# EAGLE design Thermocouple-Interface-3V3 (EAGLE 5.11)
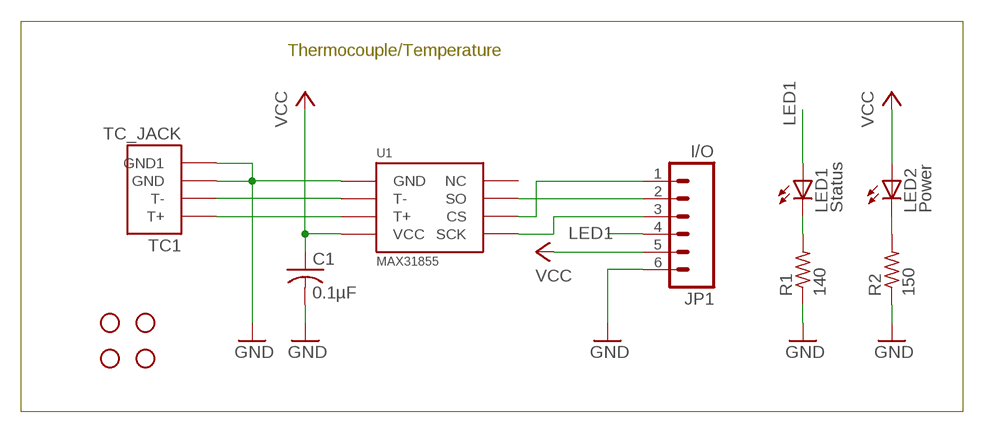
[diagram p0: schematic, sheet 1]

## Parts
C1  0.1µF  C-USC0603  [C0603]
JP1  I/O  M06SIP  [1X06]
LED1  Status  LEDCHIP-LED0805  [CHIP-LED0805]
LED2  Power  LEDCHIP-LED0805  [CHIP-LED0805]
R1  140  R-US_R0603  [R0603]
R2  150  R-US_R0603  [R0603]
TC1  TC_JACK  [TC_JACK]
U1  MAX31855  MAX6675MAX31855  [SOIC-8]
U$1  STAND-OFF  [STAND-OFF]
U$2  STAND-OFF  [STAND-OFF]
U$3  STAND-OFF  [STAND-OFF]
U$4  STAND-OFF  [STAND-OFF]

## Nets
CS: JP1.1 U1.CS
GND: C1.2 JP1.6 R1.1 R2.1 TC1.P$1(GND) TC1.P$2(GND1) U1.GND
LED1: JP1.4 LED1.A
N$1: LED1.C R1.2
N$2: LED2.C R2.2
SCK: JP1.3 U1.SCK
SO: JP1.2 U1.SO
T+: TC1.T+ U1.T+
T-: TC1.T- U1.T-
VCC: C1.1 JP1.5 LED2.A U1.VCC
Unconnected: U1.NC

## Notes on the sheet
- Thermocouple/Temperature

## Library data of the parts
C1 = resistor:C-US: CAPACITOR, American symbol
JP1 = SparkFun:M06: Header 6 Standard 6-pin 0.1" header. Use with straight break away headers (SKU : PRT-00116), right angle break away headers (PRT-00553), swiss pins (PRT-00743), machine pins (PRT-00117), and female headers (PRT-00115). Molex polarized connector foot print use with SKU : PRT-08094 with associated crimp pins and housings. NOTES ON THE VARIANTS LOCK and LOCK_LONGPADS... This footprint was designed to help hold the alignment of a through-hole component (i.e. 6-pin header) while soldering it into place. You may notice that each hole has been shifted either up or down by 0.005 of an inch from it's more standard position (which is a perfectly straight line). This slight alteration caused the pins (the squares in the middle) to touch the edges of the holes. Because they are alternating, it causes a "brace" to hold the component in place. 0.005 has proven to be the perfect amount of "off-center" position when using our standard breakaway headers. Although looks a little odd when you look at the bare footprint, once you have a header in there, the alteration is very hard to notice. Also, if you push a header all the way into place, it is covered up entirely on the bottom side. This idea of altering the position of holes to aid alignment will be further integrated into the Sparkfun Library for other footprints. It can help hold any component with 3 or more connection pins.
LED1 LED2 = led:LED: LED OSRAM: - CHIPLED LG R971, LG N971, LY N971, LG Q971, LY Q971, LO R971, LY R971 LH N974, LH R974 LS Q976, LO Q976, LY Q976 LO Q996 - Hyper CHIPLED LW Q18S LB Q993, LB Q99A, LB R99A - SideLED LS A670, LO A670, LY A670, LG A670, LP A670 LB A673, LV A673, LT A673, LW A673 LH A674 LY A675 LS A676, LA A676, LO A676, LY A676, LW A676 LS A679, LY A679, LG A679 - Hyper Micro SIDELED® LS Y876, LA Y876, LO Y876, LY Y876 LT Y87S - SmartLED LW L88C, LW L88S LB L89C, LB L89S, LG L890 LS L89K, LO L89K, LY L89K LS L896, LA L896, LO L896, LY L896 - TOPLED LS T670, LO T670, LY T670, LG T670, LP T670 LSG T670, LSP T670, LSY T670, LOP T670, LYG T670 LG T671, LOG T671, LSG T671 LB T673, LV T673, LT T673, LW T673 LH T674 LS T676, LA T676, LO T676, LY T676, LB T676, LH T676, LSB T676, LW T676 LB T67C, LV T67C, LT T67C, LS T67K, LO T67K, LY T67K, LW E67C LS E67B, LA E67B, LO E67B, LY E67B, LB E67C, LV E67C, LT E67C LW T67C LS T679, LY T679, LG T679 LS T770, LO T770, LY T770, LG T770, LP T770 LB T773, LV T773, LT T773, LW T773 LH T774 LS E675, LA E675, LY E675, LS T675 LS T776, LA T776, LO T776, LY T776, LB T776 LHGB T686 LT T68C, LB T68C - Hyper Mini TOPLED® LB M676 - Mini TOPLED Santana® LG M470 LS M47K, LO M47K, LY M47K Source: http://www.osram.convergy.de LUXEON: - LUMILED® LXK2-PW12-R00, LXK2-PW12-S00, LXK2-PW14-U00, LXK2-PW14-V00 LXK2-PM12-R00, LXK2-PM12-S00, LXK2-PM14-U00 LXK2-PE12-Q00, LXK2-PE12-R00, LXK2-PE12-S00, LXK2-PE14-T00, LXK2-PE14-U00 LXK2-PB12-K00, LXK2-PB12-L00, LXK2-PB12-M00, LXK2-PB14-N00, LXK2-PB14-P00, LXK2-PB14-Q00 LXK2-PR12-L00, LXK2-PR12-M00, LXK2-PR14-Q00, LXK2-PR14-R00 LXK2-PD12-Q00, LXK2-PD12-R00, LXK2-PD12-S00 LXK2-PH12-R00, LXK2-PH12-S00 LXK2-PL12-P00, LXK2-PL12-Q00, LXK2-PL12-R00 Source: www.luxeon.com KINGBRIGHT: KA-3528ASYC Source: www.kingbright.com
R1 R2 = resistor:R-US_: RESISTOR, American symbol
TC1 = McLaughlinEng:TC_JACK
U1 = McLEng:MAX6675
U$1-U$4 = SparkFun:STAND-OFF: Stand Off This is the mechanical footprint for a #4 phillips button head screw. Use the keepout ring to avoid running the screw head into surrounding components. SKU : PRT-00447

## Board
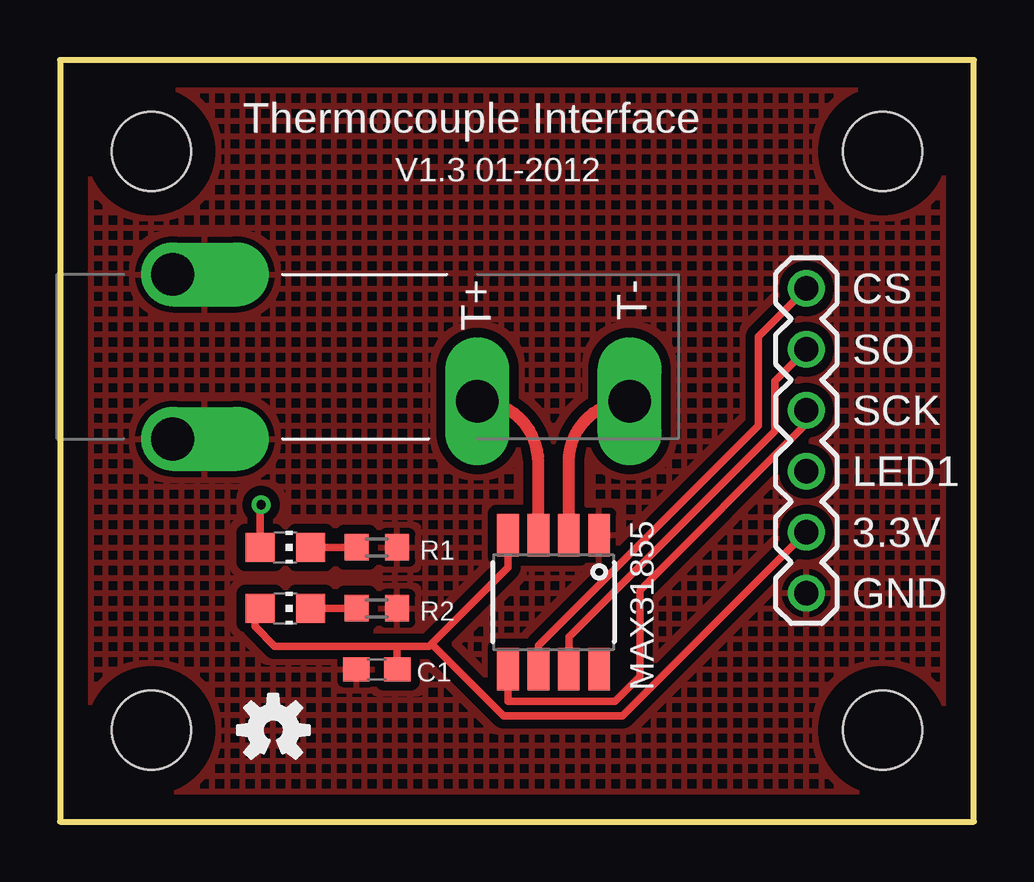
[diagram p1: board, top side]
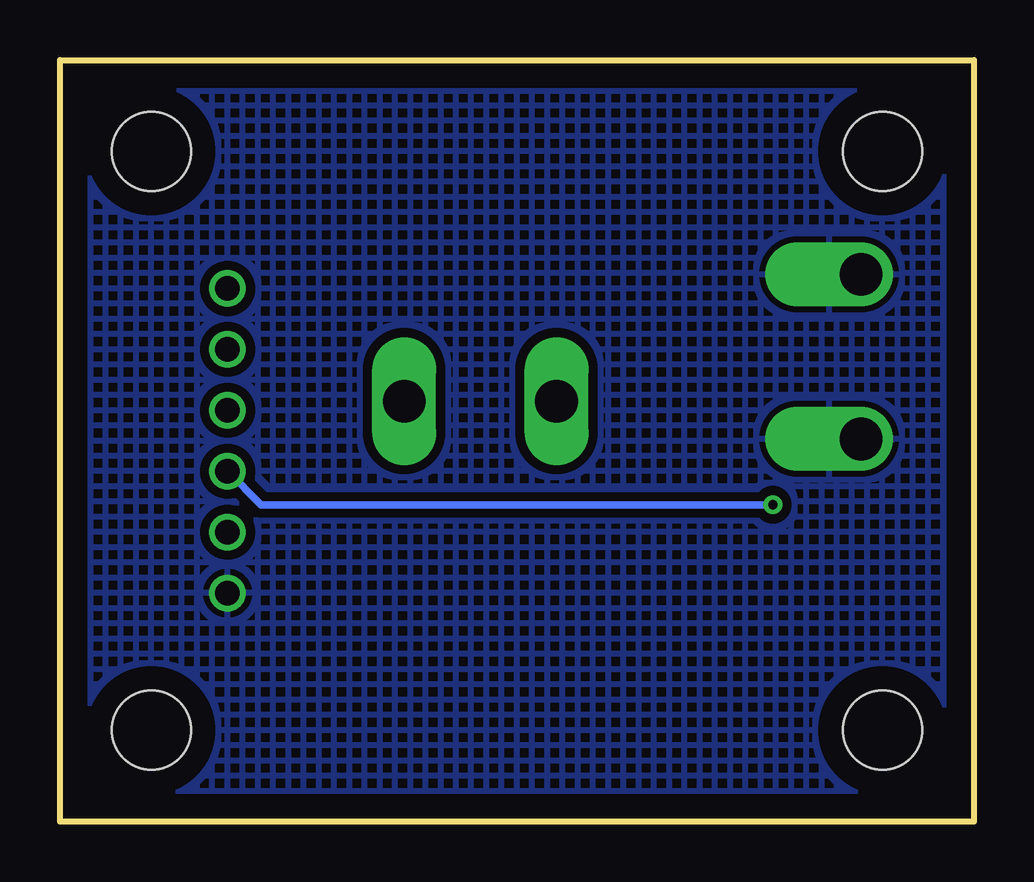
[diagram p2: board, bottom side, seen from below]

Size 38.1 x 31.75 mm. Coordinates in mm from the lower left corner, seen from the top.
Outline: 0,31.75 0,0 38.1,0 38.1,31.75 0,31.75
Copper layers (1*16): Top 0.035mm / dielectric 1.5mm / Bottom 0.035mm
Design rules: minimum track width 10mil, minimum drill 16mil, track to track 10mil, track to pad 10mil, pad to pad 8mil, via to via 8mil, smd to smd 8mil, copper to edge 40mil, drill to drill 10mil, minimum pad ring 10mil, minimum via ring 8mil, stop-mask expansion 4mil, vias tented up to drill 25mil, thermal gap 10mil

### Footprints (pad centres in the part's own frame; a part is rotated, then mirrored left to right if it is on the bottom)
C0603 = smd 1.1 x 1: 1 -0.85,0; 2 0.85,0
1X06 = drill 1.016: 1 0,0; 2 2.54,0; 3 5.08,0; 4 7.62,0; 5 10.16,0; 6 12.7,0
CHIP-LED0805 = smd 1.2 x 1.2: A 0,-1.05; C 0,1.05
R0603 = smd 1 x 1.1: 1 -0.85,0; 2 0.85,0
TC_JACK = drill 1.778 offset: P$1 -5.283,0; P$2 1.575,0 | drill 1.778 long: T+ 0,12.7; T- 0,19.05
SOIC-8 = smd 1.778 x 0.914: CS 2.794,-0.635; GND -2.794,1.905; NC 2.794,1.905; SCK 2.794,-1.905; SO 2.794,0.635; T+ -2.794,-0.635; T- -2.794,0.635; VCC -2.794,-1.905
STAND-OFF = hole 3.302: 0,0

### Placement (x,y rotation side)
C1  13.21,6.35 180 top
JP1  31.11,22.23 270 top
LED1  9.4,11.43 270 top
LED2  9.4,8.89 270 top
R1  13.21,11.43 180 top
R2  13.21,8.89 180 top
TC1  4.7,17.53 270 top
U1  20.57,9.14 270 top
U$1  34.29,27.94 270 top
U$2  3.81,27.94 270 top
U$3  34.29,3.81 270 top
U$4  3.81,3.81 270 top
U$5  [OSHW-LOGO-S]  8.89,3.81 0 top

### Tracks (layer width: path | path; a pad name or v marks a point on that pad's centre or on a via)
CS
  Top 0.305: JP1.1 29.11,20.22 29.11,16.51 20.3,7.7 19.94,7.34 U1.CS
GND
  pour Top (isolate 0.381, hatched): 38.1,31.75 38.1,0 0,0 0,31.75
  pour Bottom (isolate 0.381, hatched): 38.1,31.75 38.1,0 0,0 0,31.75
LED1  (via drill 0.38)
  Top 0.305: v8.38,13.21 8.35,13.17 LED1.A
  Bottom 0.305: JP1.4 29.72,13.21 v8.38,13.21
N$1
  Top 0.305: LED1.C R1.2
N$2
  Top 0.305: LED2.C R2.2
SCK
  Top 0.305: U1.SCK 18.67,5 23.13,5 24.17,6.05 24.17,9.64 31.11,16.59 JP1.3
SO
  Top 0.305: U1.SO 21.21,7.7 29.79,16.28 29.79,18.36 JP1.2
T+
  Top 0.508: TC1.T+ arc-90 19.94,14.99 U1.T+
T-
  Top 0.508: TC1.T- arc90 21.21,14.99 U1.T-
VCC
  Top 0.305: 15.48,7.4 18.48,4.4 23.45,4.4 JP1.5 | 15.48,7.4 15.38,7.31 14.06,7.31 | 15.48,7.4 18.67,10.59 U1.VCC | 14.06,7.31 9.93,7.31 8.95,7.31 8.13,8.13 8.13,8.67 LED2.A | 14.06,7.31 C1.1

### Text on the board
tPlace: Thermocouple Interface | V1.3 01-2012 | CS | SO | SCK | LED1 | 3.3V | GND